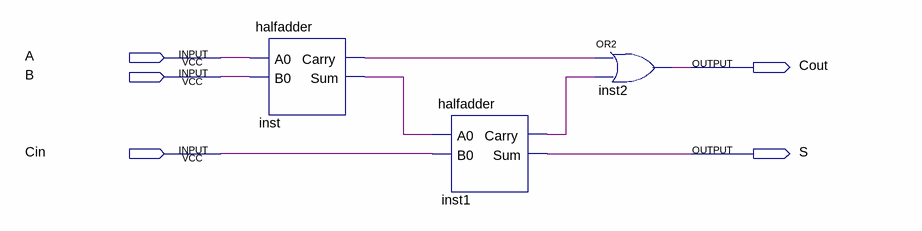
[diagram p0: schematic sheet]
// Quartus schematic fulladder.bdf as structural Verilog: 3 symbols, 5 pins
module fulladder (
  input  A,
  input  B,
  input  Cin,
  output Cout,
  output S
);

  wire inst1_carry, inst_carry, inst_sum;

  halfadder inst (.A0(A), .B0(B), .Carry(inst_carry), .Sum(inst_sum));
  halfadder inst1 (.A0(inst_sum), .B0(Cin), .Carry(inst1_carry), .Sum(S));
  or inst2 (Cout, inst_carry, inst1_carry);
endmodule
